# EAGLE design main (EAGLE 7.7.0)
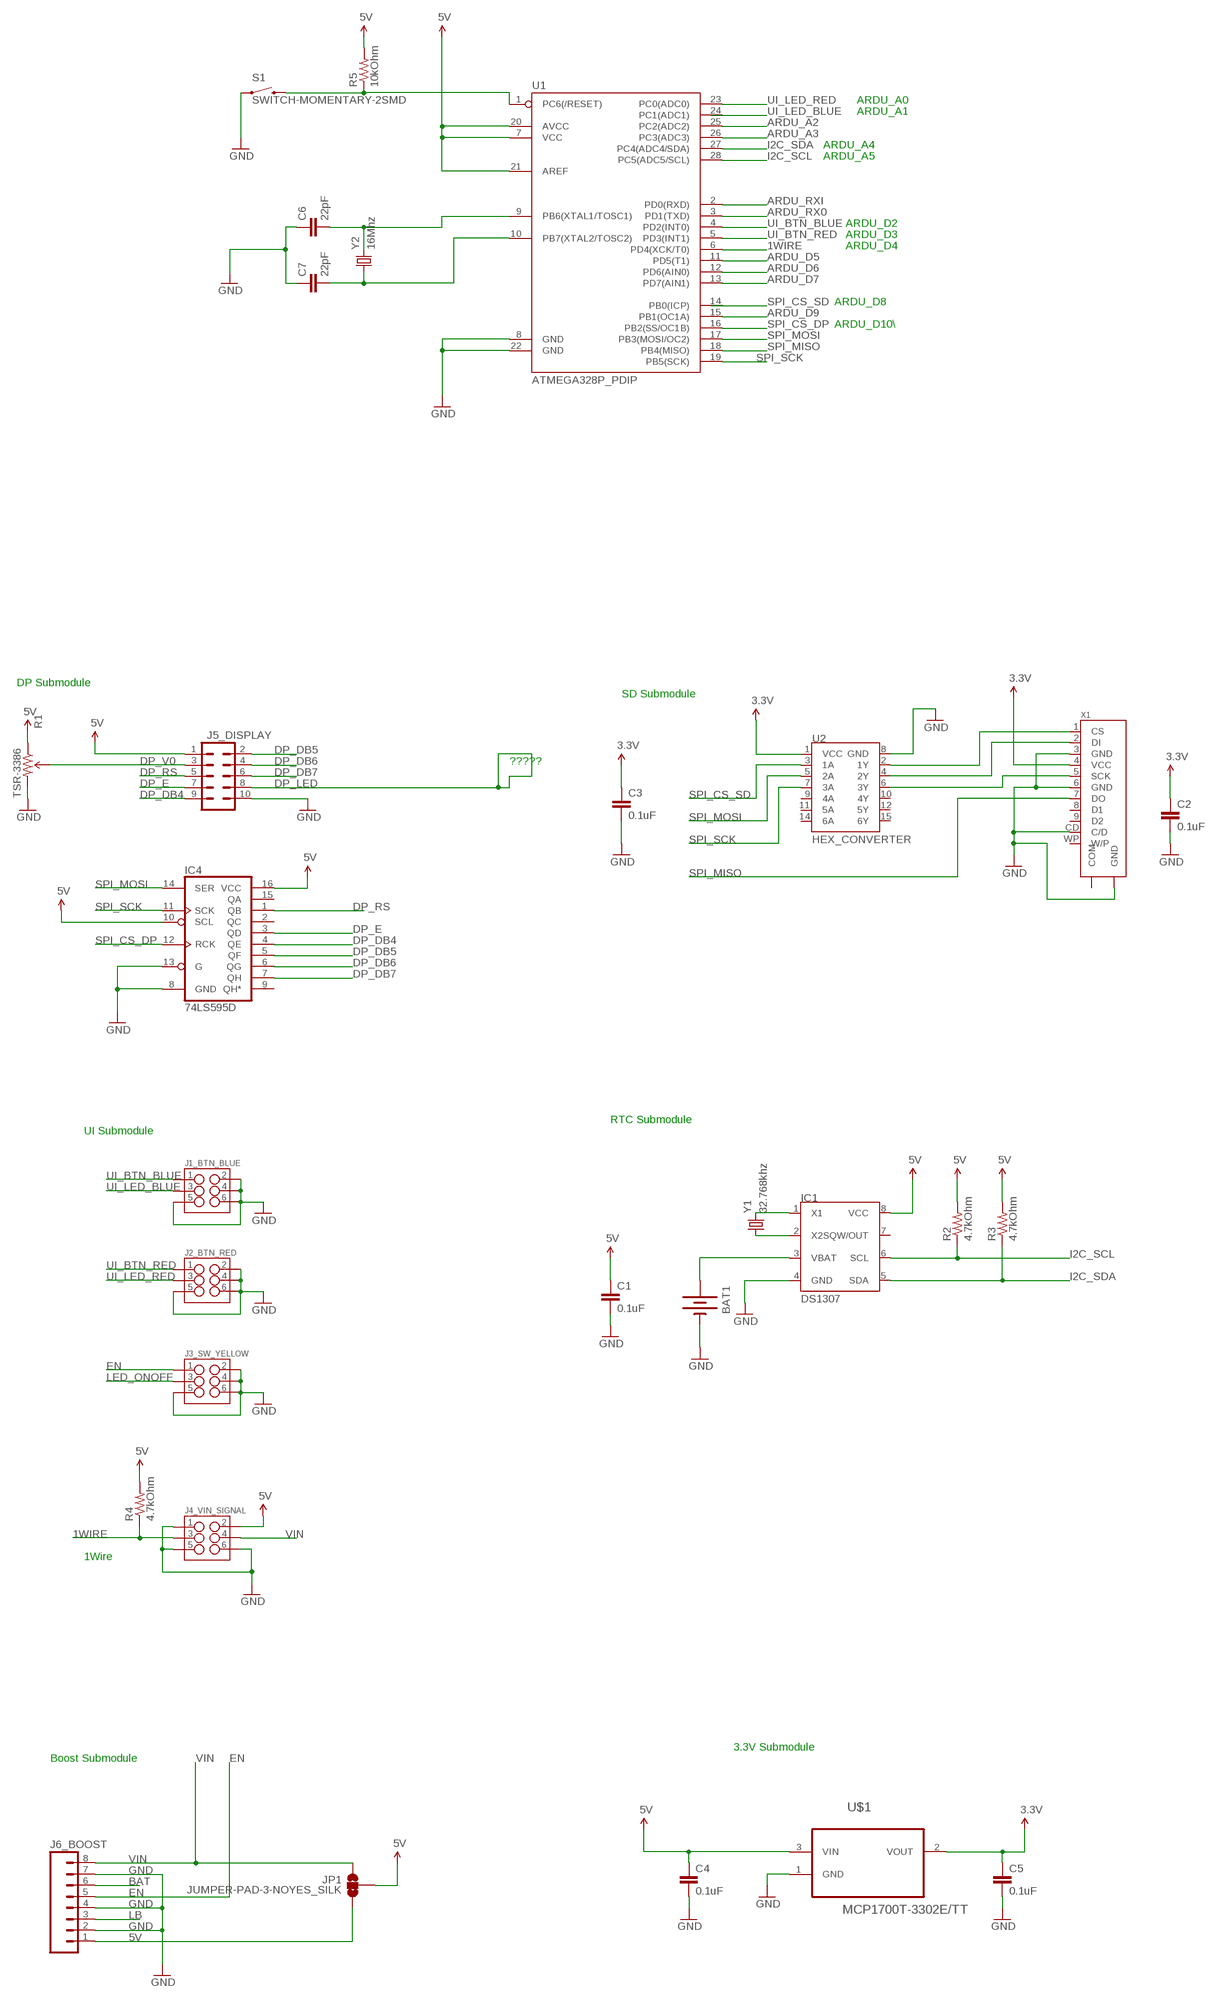
[diagram p0: schematic, sheet 1]

## Parts
BAT1  BATTERY20PTH  [BATTCOM_20MM_PTH]
C1  0.1uF  CAP1206  [1206]
C2  0.1uF  CAP1206  [1206]
C3  0.1uF  CAP1206  [1206]
C4  0.1uF  CAP1206  [1206]
C5  0.1uF  CAP1206  [1206]
C6  22pF  CAP1206  [1206]
C7  22pF  CAP1206  [1206]
IC1  DS1307  [SOIC-8]
IC4  74LS595D  [SO16]
J1_BTN_BLUE  M03X2SHROUD  [2X3-SHROUDED]
J2_BTN_RED  M03X2SHROUD  [2X3-SHROUDED]
J3_SW_YELLOW  M03X2SHROUD  [2X3-SHROUDED]
J4_VIN_SIGNAL  M03X2SHROUD  [2X3-SHROUDED]
J5_DISPLAY  M05X2SHD  [2X5-SHROUDED]
J6_BOOST  M08  [1X08_ROUND]
JP1  JUMPER-PAD-3-NOYES_SILK  [PAD-JUMPER-3-NO_YES_SILK]
R1  TSR-3386  TRIMPOT-PTH-KNOB  [3386U]
R2  4.7kOhm  RESISTOR1206  [1206]
R3  4.7kOhm  RESISTOR1206  [1206]
R4  4.7kOhm  RESISTOR1206  [1206]
R5  10kOhm  RESISTOR1206  [1206]
S1  SWITCH-MOMENTARY-2SMD  [TACTILE-SWITCH-SMD]
U1  ATMEGA328P_PDIP  [DIL28-3]
U2  HEX_CONVERTER  [SO016]
U$1  MCP1700T-3302E/TT  [SOT95P237X112-3N]
X1  SD-SOCKET-AVX  [SD-SOCKET-AVX]
Y1  32.768khz  CRYSTAL32-SMD-MELF  [CRYSTAL-32KHZ-SMD-MELF]
Y2  16Mhz  CRYSTALHC49US  [HC49US]

## Nets
1WIRE: J4_VIN_SIGNAL.3 R4.1 U1.6(PD4(XCK/T0))
3.3V: C2.1 C3.1 C5.1 U2.1(VCC) U$1.2(VOUT) X1.4(VCC)
5V: C1.1 C4.1 IC1.8(VCC) IC4.10(SCL) IC4.16(VCC) J4_VIN_SIGNAL.2 J5_DISPLAY.1 J6_BOOST.1 JP1.2 JP1.3 R1.1(CCW) R2.2 R3.2 R4.2 R5.2 U1.7(VCC) U1.20(AVCC) U1.21(AREF) U$1.3(VIN)
ARDU_A2: U1.25(PC2(ADC2))
ARDU_A3: U1.26(PC3(ADC3))
ARDU_D5: U1.11(PD5(T1))
ARDU_D6: U1.12(PD6(AIN0))
ARDU_D7: U1.13(PD7(AIN1))
ARDU_D9: U1.15(PB1(OC1A))
ARDU_RX0: U1.3(PD1(TXD))
ARDU_RXI: U1.2(PD0(RXD))
BAT: J6_BOOST.6
DP_DB4: IC4.4(QE) J5_DISPLAY.9
DP_DB5: IC4.5(QF) J5_DISPLAY.2
DP_DB6: IC4.6(QG) J5_DISPLAY.4
DP_DB7: IC4.7(QH) J5_DISPLAY.6
DP_E: IC4.3(QD) J5_DISPLAY.7
DP_LED: J5_DISPLAY.8
DP_RS: IC4.1(QB) J5_DISPLAY.5
DP_V0: J5_DISPLAY.3 R1.2(WIPER)
EN: J3_SW_YELLOW.1 J6_BOOST.5
GND: BAT1.2(-) C1.2 C2.2 C3.2 C4.2 C5.2 C6.1 C7.1 IC1.4(GND) IC4.8(GND) IC4.13(G) J1_BTN_BLUE.2 J1_BTN_BLUE.4 J1_BTN_BLUE.5 J1_BTN_BLUE.6 J2_BTN_RED.2 J2_BTN_RED.4 J2_BTN_RED.5 J2_BTN_RED.6 J3_SW_YELLOW.2 J3_SW_YELLOW.4 J3_SW_YELLOW.5 J3_SW_YELLOW.6 J4_VIN_SIGNAL.1 J4_VIN_SIGNAL.5 J4_VIN_SIGNAL.6 J5_DISPLAY.10 J6_BOOST.2 J6_BOOST.4 J6_BOOST.7 R1.3(CW) S1.1 U1.8(GND) U1.22(GND) U2.8(GND) U$1.1(GND) X1.3(GND) X1.6(GND) X1.CD(C/D) X1.GND@2(GND)
I2C_SCL: IC1.6(SCL) R2.1 U1.28(PC5(ADC5/SCL))
I2C_SDA: IC1.5(SDA) R3.1 U1.27(PC4(ADC4/SDA))
LB: J6_BOOST.3
LED_ONOFF: J3_SW_YELLOW.3
N$1: BAT1.1(+) IC1.3(VBAT)
N$2: IC1.2(X2) Y1.X1
N$3: IC1.1(X1) Y1.X2
N$4: U2.2(1Y) X1.1(CS)
N$5: U2.4(2Y) X1.2(DI)
N$6: U2.6(3Y) X1.5(SCK)
N$7: R5.1 S1.3 U1.1(PC6(/RESET))
N$10: C6.2 U1.9(PB6(XTAL1/TOSC1)) Y2.2
N$11: C7.2 U1.10(PB7(XTAL2/TOSC2)) Y2.1
SPI_CS_DP: IC4.12(RCK) U1.16(PB2(SS/OC1B))
SPI_CS_SD: U2.3(1A)
SPI_MISO: U1.18(PB4(MISO)) X1.7(DO)
SPI_MOSI: IC4.14(SER) U1.17(PB3(MOSI/OC2)) U2.5(2A)
SPI_SCK: IC4.11(SCK) U1.19(PB5(SCK)) U2.7(3A)
UI_BTN_BLUE: J1_BTN_BLUE.1 U1.4(PD2(INT0))
UI_BTN_RED: J2_BTN_RED.1 U1.5(PD3(INT1))
UI_LED_BLUE: J1_BTN_BLUE.3
UI_LED_RED: J2_BTN_RED.3 U1.23(PC0(ADC0))
VIN: J4_VIN_SIGNAL.4 J6_BOOST.8 JP1.1
Unconnected: IC1.7(SQW/OUT) IC4.2(QC) IC4.9(QH*) IC4.15(QA) U1.14(PB0(ICP)) U1.24(PC1(ADC1)) U2.9(4A) U2.10(4Y) U2.11(5A) U2.12(5Y) U2.14(6A) U2.15(6Y) X1.8(D1) X1.9(D2) X1.COM X1.WP(W/P)

## Notes on the sheet
- ARDU_A0
- ARDU_A1
- ARDU_A4
- ARDU_A5
- ARDU_D2
- ARDU_D3
- ARDU_D4
- ARDU_D8
- ARDU_D10\
- DP Submodule
- SD Submodule
- ?????
- RTC Submodule
- UI Submodule
- 1Wire
- 3.3V Submodule
- Boost Submodule

## Library data of the parts
BAT1 = SparkFun-Electromechanical:BATTERY: Battery Holders Various common sizes : AA, AAA, 18650 (PRT-12895), 20mm coin cell and 12mm coin cell. 20MM_4LEGS, BATT-10373
C1-C7 = SparkFun-Passives:CAP: Capacitor Standard 0603 ceramic capacitor, and 0.1" leaded capacitor.
IC1 = dallas-1:DS1307: I2C Serial RTC w/56 bytes battery backed RAM
IC4 = SparkFun-DigitalIC:74*595: 8-bit SHIFT REGISTER, output latch; PROD_ID: IC-07875
J1_BTN_BLUE J2_BTN_RED J3_SW_YELLOW J4_VIN_SIGNAL = SparkFun-Connectors:M03X2: 2x3 .1" header. Shrouded, with keying- CONN-10681 SMT- CONN-11415 Pogo pins- HW-11044; PROD_ID: CONN-10681
J5_DISPLAY = SparkFun-Connectors:M05X2: Header 5x2 Standard 10-pin dual row 0.1" header. Commonly used with AVR-ISP. Use with Spark Fun Electronics SKU: PRT-00778
J6_BOOST = SparkFun-Connectors:M08: Header 8 Standard 8-pin 0.1" header. Use with straight break away headers (SKU : PRT-00116), right angle break away headers (PRT-00553), swiss pins (PRT-00743), machine pins (PRT-00117), and female headers (PRT-00115).; PROD_ID: CONN-08437
JP1 = SparkFun-Passives:JUMPER-PAD-3-NO
R1 = SparkFun-Electromechanical:TRIMPOT: Various small potentiometers for "set-and-forget" applications; PROD_ID: RES-09730
R2-R5 = SparkFun-Resistors:RESISTOR: Resistor Basic schematic elements and footprints for 0603, 1206, and PTH resistors.
S1 = SparkFun-Electromechanical:SWITCH-MOMENTARY-2: Various NO switches- pushbuttons, reed, etc; PROD_ID: SWCH-08247
U1 = SparkFun-DigitalIC:ATMEGA328P_PDIP: uC used in the Arduino 32kb flash, 1k EEPROM, 2k SRAM This is the through-hole version of this chip.
U2 = SparkFun-DigitalIC:HEX_CONVERTER: 74HC4050 Hex Buffer Level Shifter SMD SO016; PROD_ID: IC-09604
U$1 = Microchip_By_element14_Batch_1:MCP1700T-3302E/TT: Low Quiescent Current LDO; MPN: MCP1700T-3302E/TT; OC_FARNELL: 1296592; OC_NEWARK: 88H9817; PACKAGE: SOT23-3; SUPPLIER: Microchip
X1 = Lumisense-SD-Socket:SD-SOCKET: SD-SOCKET; LPN: 181; NOTES: DIGIKEY 478-4061-1-ND
Y1 = SparkFun-FreqCtrl:CRYSTAL: Various standard crystals. Proven footprints.; PROD_ID: XTAL-07894
Y2 = SparkFun-FreqCtrl:CRYSTAL: Various standard crystals. Proven footprints.

## Board
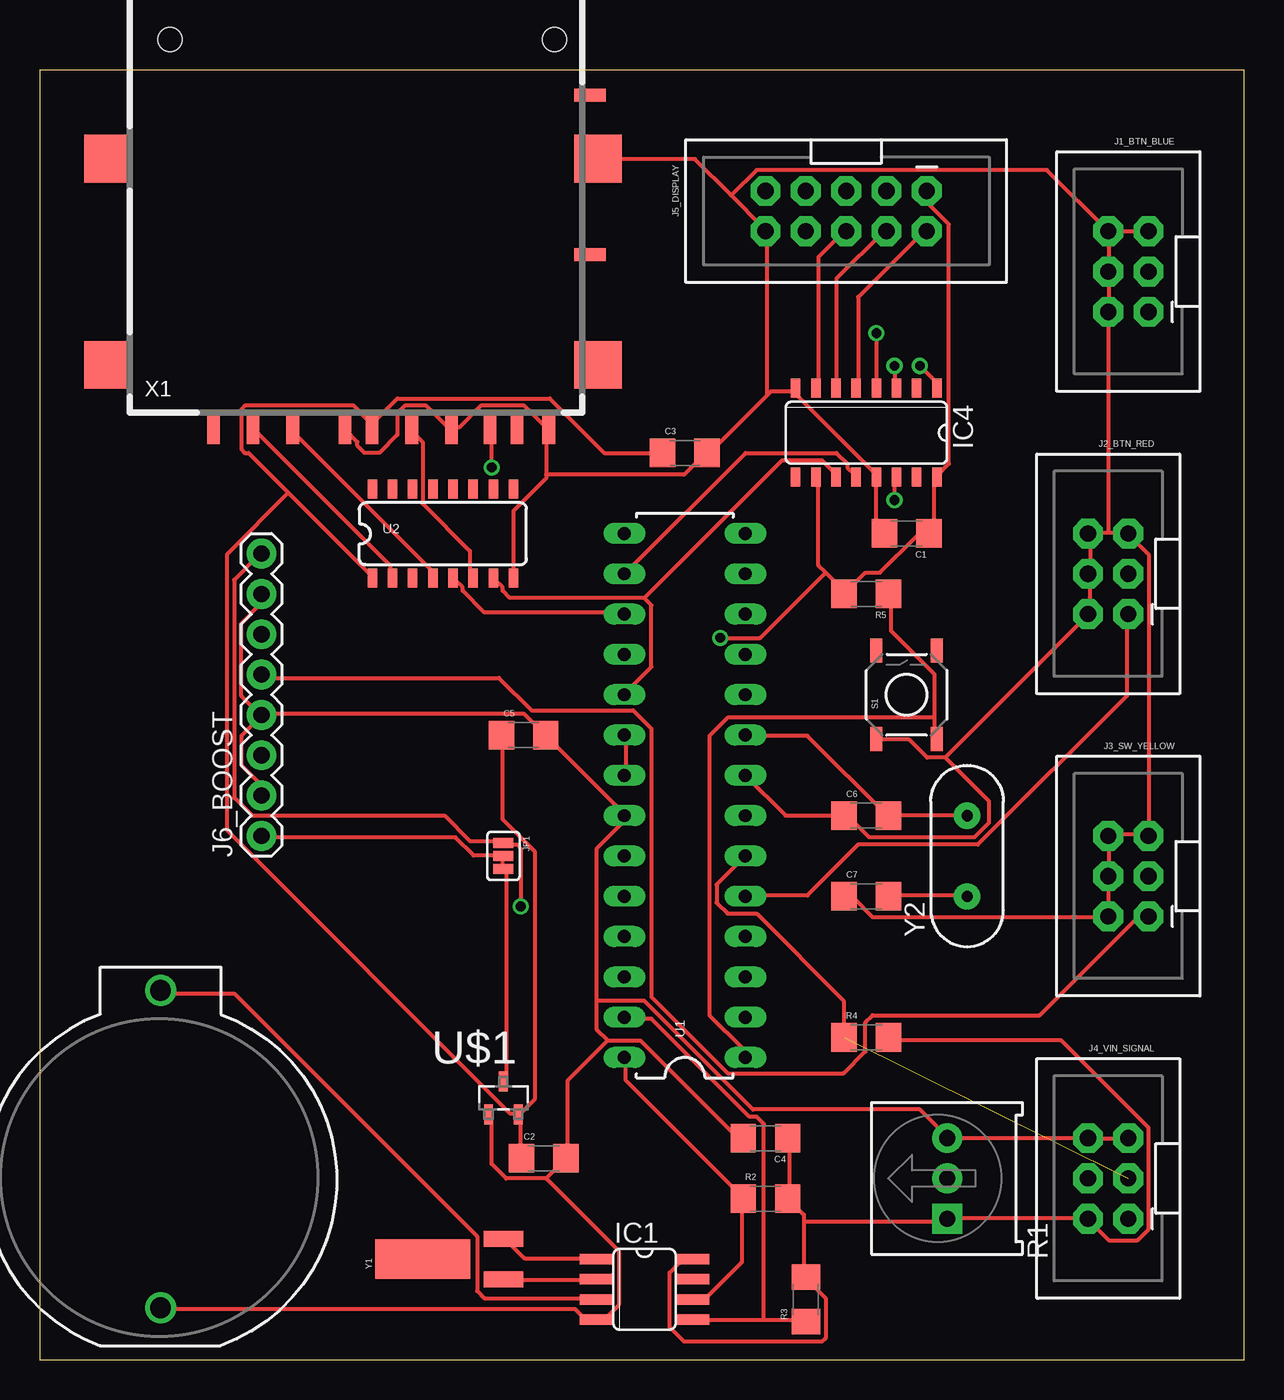
[diagram p1: board, top side]
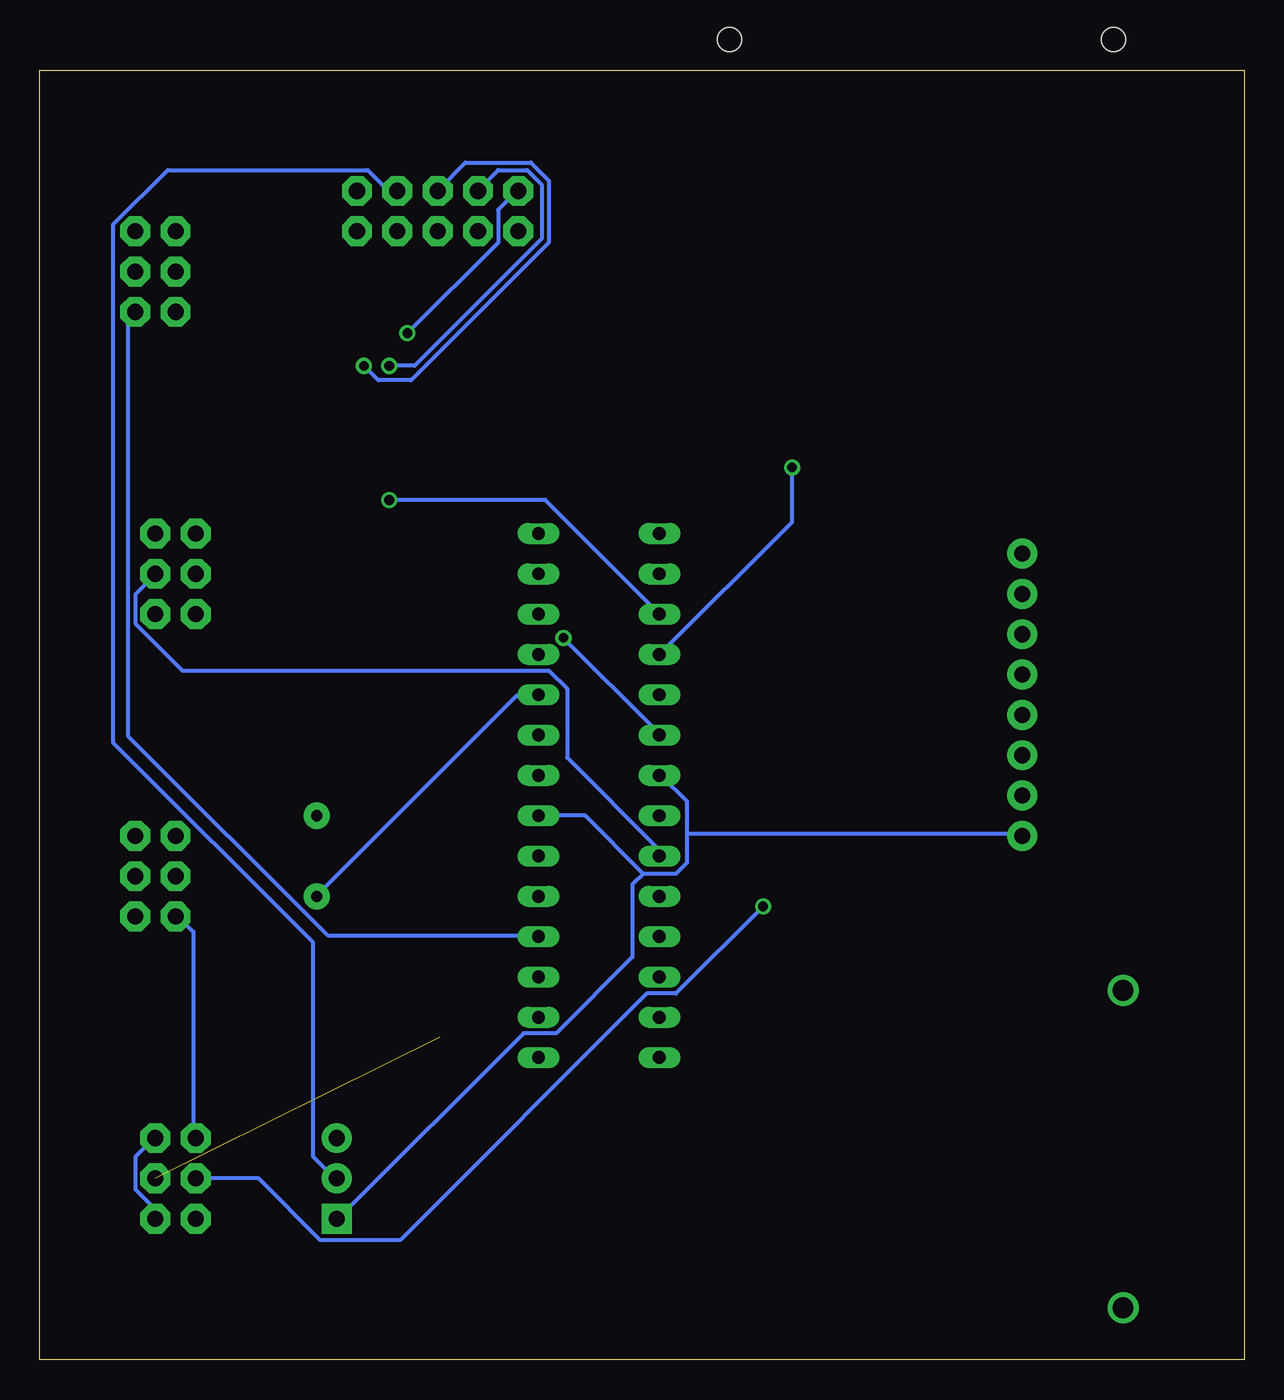
[diagram p2: board, bottom side, seen from below]

Size 75.87 x 81.27 mm. Coordinates in mm from the lower left corner, seen from the top.
Outline: 0,0 75.87,0 75.87,81.27 0,81.27 0,0
Copper layers (1*16): Top 0.035mm / dielectric 1.5mm / Bottom 0.035mm
Design rules "default": minimum track width 10mil, minimum drill 24mil, track to track 8mil, track to pad 8mil, pad to pad 8mil, via to via 8mil, smd to smd 8mil, copper to edge 40mil, drill to drill 8mil, minimum pad ring 10mil, minimum via ring 8mil, stop-mask expansion 4mil, vias tented up to drill 0mil, thermal gap 10mil

### Footprints (pad centres in the part's own frame; a part is rotated, then mirrored left to right if it is on the bottom)
BATTCOM_20MM_PTH = drill 1.3: 1 11.85,0; 2 -8.15,0
1206 = smd 1.6 x 1.8: 1 -1.4,0; 2 1.4,0
SOIC-8 = smd 2.032 x 0.66: 1 -3.073,1.27; 2 -3.073,0; 3 -3.073,-1.27; 4 -3.073,-2.54; 5 3.073,-2.54; 6 3.073,-1.27; 7 3.073,0; 8 3.073,1.27
SO16 = smd 0.6 x 1.2: 1 -4.445,-2.8; 2 -3.175,-2.8; 3 -1.905,-2.8; 4 -0.635,-2.8; 5 0.635,-2.8; 6 1.905,-2.8; 7 3.175,-2.8; 8 4.445,-2.8; 9 4.445,2.8; 10 3.175,2.8; 11 1.905,2.8; 12 0.635,2.8; 13 -0.635,2.8; 14 -1.905,2.8; 15 -3.175,2.8; 16 -4.445,2.8
2X3-SHROUDED = drill 1.016 pad 1.88 octagon: 1 -1.27,2.54; 2 1.27,2.54; 3 -1.27,0; 4 1.27,0; 5 -1.27,-2.54; 6 1.27,-2.54
2X5-SHROUDED = drill 1.016 pad 1.88 octagon: 1 -1.27,5.08; 2 1.27,5.08; 3 -1.27,2.54; 4 1.27,2.54; 5 -1.27,0; 6 1.27,0; 7 -1.27,-2.54; 8 1.27,-2.54; 9 -1.27,-5.08; 10 1.27,-5.08
1X08_ROUND = drill 1.016 pad 1.88: 1 0,0; 2 2.54,0; 3 5.08,0; 4 7.62,0; 5 10.16,0; 6 12.7,0; 7 15.24,0; 8 17.78,0
PAD-JUMPER-3-NO_YES_SILK = smd 0.635 x 1.27: 1 -0.813,0; 2 0,0; 3 0.813,0
3386U = drill 1.016 pad 1.88 square: 1 -2.54,-0.015 | drill 1.016 pad 1.88: 2 0,-0.015; 3 2.54,-0.015
TACTILE-SWITCH-SMD = smd 1.524 x 0.762: 1 -2.794,1.905; 2 2.794,1.905; 3 -2.794,-1.905; 4 2.794,-1.905
DIL28-3 = drill 0.813 long: 1 -16.51,-3.81; 2 -13.97,-3.81; 3 -11.43,-3.81; 4 -8.89,-3.81; 5 -6.35,-3.81; 6 -3.81,-3.81; 7 -1.27,-3.81; 8 1.27,-3.81; 9 3.81,-3.81; 10 6.35,-3.81; 11 8.89,-3.81; 12 11.43,-3.81; 13 13.97,-3.81; 14 16.51,-3.81; 15 16.51,3.81; 16 13.97,3.81; 17 11.43,3.81; 18 8.89,3.81; 19 6.35,3.81; 20 3.81,3.81; 21 1.27,3.81; 22 -1.27,3.81; 23 -3.81,3.81; 24 -6.35,3.81; 25 -8.89,3.81; 26 -11.43,3.81; 27 -13.97,3.81; 28 -16.51,3.81
SO016 = smd 0.6 x 1.2: 1 -4.445,-2.8; 2 -3.175,-2.8; 3 -1.905,-2.8; 4 -0.635,-2.8; 5 0.635,-2.8; 6 1.905,-2.8; 7 3.175,-2.8; 8 4.445,-2.8; 9 4.445,2.8; 10 3.175,2.8; 11 1.905,2.8; 12 0.635,2.8; 13 -0.635,2.8; 14 -1.905,2.8; 15 -3.175,2.8; 16 -4.445,2.8
SOT95P237X112-3N = smd 0.559 x 1.27: 1 -0.94,-1.041; 2 0.94,-1.041; 3 0,1.041
SD-SOCKET-AVX = smd 0.8 x 2: 1 -6.88,-1; 2 -4.38,-1; 3 -1.08,-1; 4 0.62,-1; 5 3.12,-1; 6 5.62,-1; 7 8.05,-1; 8 9.75,-1; 9 -9.38,-1; CD 11.75,-1 | smd 2 x 0.8: COM 14.35,9.95; WP 14.35,20 | smd 3 x 3: GND@1 -16,3; GND@2 14.85,16; GND@3 -16,16; GND@4 14.85,3 | hole 1.5: 12.1,23.5; -12.1,23.5
CRYSTAL-32KHZ-SMD-MELF = smd 2.5 x 6: SHEILD 0,5.08 | smd 1 x 2.5: X1 -1.27,0; X2 1.27,0
HC49US = drill 0.7 pad 1.651: 1 -2.54,0; 2 2.54,0

### Placement (x,y rotation side)
BAT1  7.62,11.43 90 top
C1  54.61,52.07 180 top
C2  31.75,12.7 0 top
C3  40.64,57.15 0 top
C4  45.72,13.97 180 top
C5  30.48,39.37 0 top
C6  52.07,34.29 0 top
C7  52.07,29.21 0 top
IC1  38.1,5.08 0 top
IC4  52.07,58.42 180 top
J1_BTN_BLUE  68.58,68.58 180 top
J2_BTN_RED  67.31,49.53 180 top
J3_SW_YELLOW  68.58,30.48 180 top
J4_VIN_SIGNAL  67.31,11.43 180 top
J5_DISPLAY  50.8,72.39 270 top
J6_BOOST  13.97,33.02 90 top
JP1  29.21,31.75 270 top
R1  57.15,11.43 90 top
R2  45.72,10.16 0 top
R3  48.26,3.81 90 top
R4  52.07,20.32 0 top
R5  52.07,48.26 180 top
S1  54.61,41.91 90 top
U1  40.64,35.56 90 top
U2  25.4,52.07 0 top
U$1  29.21,16.51 0 top
X1  20.32,59.69 0 top
Y1  29.21,6.35 90 top
Y2  58.42,31.75 90 top

### Tracks (layer width: path | path; a pad name or v marks a point on that pad's centre or on a via)
1WIRE  (1 unrouted)
  Top 0.254: U1.6 42.65,29.95 42.65,28.8 43.33,28.12 45.16,28.12 50.65,22.63 50.65,20.34 R4.1
3.3V
  Top 0.254: U$1.2 30.3,15.32 30.3,12.8 C2.1 | C5.1 29.16,39.32 29.16,34.06 31.22,32 31.22,16.46 30.3,15.54 U$1.2 | 15.67,54.63 13.16,57.15 12.93,57.15 12.7,57.38 12.7,59.89 12.93,60.12 19.79,60.12 20.93,58.98 | 15.67,54.63 20.93,49.38 U2.1 | 20.93,58.98 21.16,58.75 X1.4 20.93,58.98 | C3.1 35.56,57.15 32.13,60.58 22.53,60.58 20.93,58.98 | 15.67,54.63 11.79,50.75 11.79,33.38 29.62,15.54 30.07,15.54 U$1.2
5V  (via drill 0.61)
  Top 0.254: C4.1 47.22,13.95 47.22,10.29 R2.2 47.22,10.06 48.13,9.14 48.13,8.69 | 48.13,8.69 48.13,5.26 R3.2 48.36,5.03 49.5,3.89 49.5,1.37 49.28,1.14 40.59,1.14 39.67,2.06 39.67,5.49 40.36,6.17 41.05,6.17 IC1.8 | R4.2 53.62,20.12 64.36,20.12 69.85,14.63 69.85,8.23 69.16,7.54 67.33,7.54 66.19,8.69 J4_VIN_SIGNAL.2 65.96,8.91 57.28,8.91 R1.1 57.05,8.69 48.13,8.69 | 49.5,49.61 50.65,48.46 R5.2 50.88,48.46 52.02,49.61 52.93,49.61 55.22,51.89 55.91,51.89 C1.1 56.13,52.12 56.36,52.35 56.36,55.55 IC4.16 56.59,55.78 57.28,56.46 57.28,71.55 55.91,72.92 55.91,73.61 J5_DISPLAY.1 | 49.5,49.61 49.05,50.06 49.05,55.55 IC4.10 | U1.21 36.93,37.03 36.93,39.32 U1.20 | U$1.3 29.39,17.6 29.39,30.86 JP1.3 29.16,31.09 29.16,31.55 JP1.2 29.16,31.77 27.33,31.77 26.19,32.92 14.07,32.92 J6_BOOST.1 | 49.5,49.61 45.39,45.49 v42.88,45.49
  Bottom 0.254: U1.7 41.5,34.29 37.85,30.63 | 37.85,30.63 35.79,30.63 35.1,31.32 35.1,33.15 | 35.1,33.15 35.1,35.2 36.7,36.8 U1.21 | 35.1,33.15 14.07,33.15 J6_BOOST.1 | v42.88,45.49 36.93,39.55 U1.20 | 37.85,30.63 38.53,29.95 38.53,25.38 43.33,20.57 45.39,20.57 57.05,8.91 R1.1
DP_DB4  (via drill 0.61)
  Top 0.254: v52.7,64.69 IC4.4
  Bottom 0.254: v52.7,64.69 46.99,70.41 46.99,72.47 45.85,73.61 J5_DISPLAY.9
DP_DB5
  Top 0.254: IC4.5 51.56,61.27 51.56,66.98 55.68,71.09 J5_DISPLAY.2
DP_DB6
  Top 0.254: IC4.6 50.19,61.27 50.19,68.12 53.16,71.09 J5_DISPLAY.4
DP_DB7
  Top 0.254: IC4.7 49.05,61.27 49.05,69.49 50.65,71.09 J5_DISPLAY.6
DP_E  (via drill 0.61)
  Top 0.254: v53.85,62.64 53.85,61.27 IC4.3
  Bottom 0.254: v53.85,62.64 52.25,62.64 44.25,70.64 44.25,74.07 45.16,74.98 46.99,74.98 48.13,73.84 J5_DISPLAY.7
DP_RS  (via drill 0.61)
  Top 0.254: v55.45,62.64 56.36,61.72 56.36,61.27 IC4.1
  Bottom 0.254: v55.45,62.64 54.53,61.72 52.48,61.72 43.79,70.41 43.79,74.3 44.93,75.44 49.05,75.44 50.65,73.84 J5_DISPLAY.5
DP_V0
  Bottom 0.254: J5_DISPLAY.3 53.39,73.84 54.08,73.84 55.22,74.98 67.79,74.98 71.22,71.55 71.22,38.86 58.65,26.29 58.65,12.8 57.28,11.43 R1.2
EN
  Top 0.254: J3_SW_YELLOW.1 69.85,27.89 69.16,27.89 62.99,21.72 52.48,21.72 52.02,21.26 52.02,19.43 50.65,18.06 43.33,18.06 38.53,22.86 38.53,39.78 37.39,40.92 30.99,40.92 28.93,42.98 14.07,42.98 J6_BOOST.5
GND
  Top 0.254: J6_BOOST.2 13.84,35.66 13.84,36.35 12.7,37.49 12.7,39.32 13.84,40.46 J6_BOOST.4 | J6_BOOST.7 13.84,48.23 13.84,47.55 12.7,46.41 12.7,41.83 13.84,40.69 J6_BOOST.4 | 31.9,11.43 29.39,11.43 28.47,12.34 28.47,15.32 U$1.1 | 31.9,11.43 33.05,12.57 C2.2 33.27,12.8 33.27,17.6 35.79,20.12 | 35.79,20.12 37.85,20.12 43.79,14.17 44.25,14.17 C4.2 | 31.9,11.43 36.47,6.86 36.47,3.43 35.79,2.74 35.1,2.74 IC1.4 34.87,2.74 34.19,2.74 33.73,3.2 7.67,3.2 BAT1.2 | 35.1,22.63 35.1,20.8 35.79,20.12 | 35.1,22.63 35.1,32.23 36.7,33.83 36.7,34.29 U1.22 36.93,34.29 31.9,39.32 C5.2 31.67,39.55 30.53,40.69 14.07,40.69 J6_BOOST.4 | X1.3 19.33,58.52 20.01,57.84 20.01,57.61 20.47,57.15 21.39,57.15 22.53,58.29 22.53,59.66 22.99,60.12 24.36,60.12 25.73,58.75 X1.6 25.96,58.75 26.42,58.75 27.79,60.12 30.53,60.12 31.9,58.75 X1.CD 31.9,58.52 31.9,55.78 | U2.8 29.85,53.49 31.9,55.55 31.9,55.78 | 43.56,73.38 45.62,71.32 J5_DISPLAY.10 45.85,71.09 45.85,60.81 | 43.56,73.38 41.28,75.67 35.33,75.67 X1.GND@2 | C1.2 53.16,52.12 52.7,52.58 IC4.13 52.7,55.78 47.45,61.04 | 47.45,61.04 46.08,61.04 45.85,60.81 | 45.85,60.81 42.19,57.15 C3.2 41.96,57.15 40.59,55.78 31.9,55.78 | 47.45,61.04 IC4.8 | J4_VIN_SIGNAL.5 68.48,13.95 66.19,13.95 J4_VIN_SIGNAL.6 65.96,13.95 57.28,13.95 R1.3 57.05,14.17 55.45,15.77 44.93,15.77 38.08,22.63 35.1,22.63 | 69.85,33.15 67.33,33.15 J3_SW_YELLOW.6 67.33,32.92 67.33,30.63 J3_SW_YELLOW.4 67.33,30.4 67.33,28.12 J3_SW_YELLOW.2 67.11,27.89 52.48,27.89 51.33,29.03 50.88,29.03 C7.1 | 67.33,68.58 67.33,66.06 J1_BTN_BLUE.2 67.33,65.84 67.33,52.12 | 67.33,71.09 69.85,71.09 J1_BTN_BLUE.5
  Top 0.254: 67.33,71.09 67.33,68.58 | 67.33,68.58 J1_BTN_BLUE.4 | 67.33,71.09 J1_BTN_BLUE.6 63.45,74.98 45.16,74.98 43.56,73.38 | 67.33,52.12 66.19,52.12 J2_BTN_RED.6 66.19,51.89 66.19,49.61 J2_BTN_RED.4 66.19,49.38 66.19,47.09 J2_BTN_RED.2 65.96,46.86 57.05,37.95 | 67.33,52.12 68.48,52.12 J2_BTN_RED.5 68.71,51.89 69.85,50.75 69.85,33.15 | U1.8 46.99,34.29 C6.1 50.88,34.29 52.25,32.92 58.88,32.92 59.79,33.83 59.79,35.2 57.05,37.95 | 57.05,37.95 55.91,37.95 54.76,39.09 52.7,39.09 S1.1 | 69.85,33.15 J3_SW_YELLOW.5
  Bottom 0.254: J4_VIN_SIGNAL.1 68.71,8.91 68.71,9.6 69.85,10.74 69.85,12.8 68.71,13.95 J4_VIN_SIGNAL.5 | J4_VIN_SIGNAL.6 66.19,14.17 66.19,26.98 67.11,27.89 J3_SW_YELLOW.2
I2C_SCL
  Top 0.254: IC1.6 41.28,3.89 41.96,3.89 44.25,6.17 44.25,10.06 R2.1 44.25,10.29 36.93,17.6 36.93,18.97 U1.28
I2C_SDA
  Top 0.254: 45.62,2.52 41.28,2.52 IC1.5 | 45.62,2.52 48.13,2.52 R3.1 | 45.62,2.52 45.62,14.86 45.16,15.32 44.7,15.32 38.53,21.49 36.93,21.49 U1.27
N$1
  Top 0.254: IC1.3 34.87,3.89 28.02,3.89 27.56,4.34 27.56,7.77 12.24,23.09 7.67,23.09 BAT1.1
N$2
  Top 0.254: IC1.2 34.87,5.03 29.39,5.03 Y1.X1
N$3
  Top 0.254: IC1.1 34.87,6.4 30.53,6.4 29.39,7.54 Y1.X2
N$4
  Top 0.254: U2.2 22.07,49.38 22.07,50.06 13.61,58.52 X1.1
N$5
  Top 0.254: U2.4 24.59,49.38 24.59,49.84 15.9,58.52 X1.2
N$6
  Top 0.254: U2.6 27.1,49.38 27.1,50.98 24.13,53.95 24.13,57.84 23.44,58.52 X1.5
N$7
  Top 0.254: 56.36,40.46 56.36,43.2 53.62,45.95 53.62,48.23 R5.1 | 56.36,40.46 56.36,39.32 S1.3 | 56.36,40.46 43.33,40.46 42.19,39.32 42.19,21.72 44.25,19.66 44.25,19.2 U1.1
N$10
  Top 0.254: Y2.2 C6.2 53.39,34.29 48.36,39.32 44.47,39.32 U1.9
N$11
  Top 0.254: C7.2 53.62,29.26 58.42,29.26 Y2.1
  Bottom 0.254: U1.10 44.47,41.83 45.85,41.83 58.42,29.26 Y2.1
SPI_CS_DP
  Top 0.254: IC4.12 51.33,55.78 50.88,56.24 50.88,56.46 50.19,57.15 44.47,57.15 36.93,49.61 U1.16
SPI_MISO  (via drill 0.61)
  Top 0.254: v28.47,56.24 28.47,58.52 X1.7
  Bottom 0.254: v28.47,56.24 28.47,52.81 U1.18
SPI_MOSI  (via drill 0.61)
  Top 0.254: U2.5 26.19,49.15 26.64,48.69 26.64,48.46 28.02,47.09 36.7,47.09 U1.17 | v53.85,54.18 53.85,55.55 IC4.14
  Bottom 0.254: v53.85,54.18 44.02,54.18 U1.17
SPI_SCK
  Top 0.254: 38.08,48.01 29.62,48.01 29.16,48.46 29.16,48.69 28.7,49.15 U2.7 | 38.08,48.01 38.53,47.55 38.53,43.66 36.93,42.06 U1.19 | 38.08,48.01 46.76,56.69 49.28,56.69 49.96,56.01 49.96,55.78 IC4.11
UI_BTN_BLUE
  Bottom 0.254: U1.4 44.47,26.75 57.73,26.75 70.31,39.32 70.31,65.38 69.85,65.84 J1_BTN_BLUE.1
UI_BTN_RED
  Top 0.254: U1.5 44.47,29.26 48.36,29.26 51.56,32.46 59.11,32.46 68.48,41.83 68.48,46.86 J2_BTN_RED.1
UI_LED_RED
  Bottom 0.254: U1.23 36.93,31.77 36.93,32.23 42.65,37.95 42.65,42.29 43.79,43.43 66.88,43.43 69.85,46.41 69.85,48.23 68.71,49.38 J2_BTN_RED.3
VIN  (via drill 0.61)
  Top 0.254: J6_BOOST.8 13.84,50.75 12.24,49.15 12.24,35.43 13.39,34.29 25.5,34.29 27.1,32.69 29.16,32.69 JP1.1 29.39,32.46 30.07,32.46 30.3,32.23 v30.3,28.57
  Bottom 0.254: J4_VIN_SIGNAL.4 62.08,11.43 58.19,7.54 53.16,7.54 37.62,23.09 35.79,23.09 v30.3,28.57